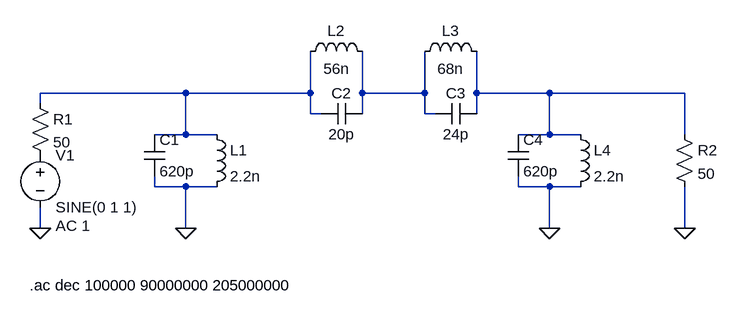
[diagram p0: schematic Elip5.asc]
Elip5.asc, the LTspice schematic file:
Version 4
SHEET 1 1208 680
WIRE 224 96 0 96
WIRE 416 96 416 32
WIRE 416 96 224 96
WIRE 496 96 496 32
WIRE 592 96 592 32
WIRE 592 96 496 96
WIRE 672 96 672 32
WIRE 784 96 672 96
WIRE 992 96 784 96
WIRE 0 112 0 96
WIRE 416 128 416 96
WIRE 432 128 416 128
WIRE 496 128 496 96
WIRE 592 128 592 96
WIRE 608 128 592 128
WIRE 672 128 672 96
WIRE 224 160 224 96
WIRE 224 160 176 160
WIRE 272 160 224 160
WIRE 784 160 784 96
WIRE 784 160 736 160
WIRE 832 160 784 160
WIRE 992 160 992 96
WIRE 176 240 176 224
WIRE 224 240 176 240
WIRE 272 240 224 240
WIRE 736 240 736 224
WIRE 784 240 736 240
WIRE 832 240 784 240
WIRE 0 304 0 272
WIRE 224 304 224 240
WIRE 784 304 784 240
WIRE 992 304 992 240
FLAG 992 304 0
FLAG 784 304 0
FLAG 224 304 0
FLAG 0 304 0
SYMBOL res -16 96 R0
SYMATTR InstName R1
SYMATTR Value 50
SYMBOL cap 160 160 R0
SYMATTR InstName C1
SYMATTR Value 620p
SYMBOL ind 256 144 R0
SYMATTR InstName L1
SYMATTR Value 2.2n
SYMBOL ind 400 48 R270
WINDOW 0 32 56 VTop 2
WINDOW 3 5 56 VBottom 2
SYMATTR InstName L2
SYMATTR Value 56n
SYMBOL cap 432 144 R270
WINDOW 0 32 32 VTop 2
WINDOW 3 0 32 VBottom 2
SYMATTR InstName C2
SYMATTR Value 20p
SYMATTR SpiceLine V=25 Irms=0 Rser=0 Lser=0
SYMBOL cap 608 144 R270
WINDOW 0 32 32 VTop 2
WINDOW 3 0 32 VBottom 2
SYMATTR InstName C3
SYMATTR Value 24p
SYMBOL ind 576 48 R270
WINDOW 0 32 56 VTop 2
WINDOW 3 5 56 VBottom 2
SYMATTR InstName L3
SYMATTR Value 68n
SYMBOL ind 816 144 R0
SYMATTR InstName L4
SYMATTR Value 2.2n
SYMBOL cap 720 160 R0
SYMATTR InstName C4
SYMATTR Value 620p
SYMBOL voltage 0 176 R0
WINDOW 123 24 124 Left 2
WINDOW 39 0 0 Left 0
SYMATTR Value2 AC 1
SYMATTR InstName V1
SYMATTR Value SINE(0 1 1)
SYMBOL res 976 144 R0
SYMATTR InstName R2
SYMATTR Value 50
TEXT -16 392 Left 2 !.ac dec 100000 90000000 205000000

The netlist it stands for:
* Elip5.asc
R1 N001 P001 50
C1 N001 0 620p
L1 N001 0 2.2n
L2 N001 N002 56n
C2 N001 N002 20p V=25 Irms=0 Rser=0 Lser=0
C3 N002 N003 24p
L3 N002 N003 68n
L4 N003 0 2.2n
C4 N003 0 620p
V1 P001 0 SINE(0 1 1) AC 1
R2 N003 0 50
.ac dec 100000 90000000 205000000
.backanno
.end